# EAGLE schematic dosimeter (EAGLE 6.1)
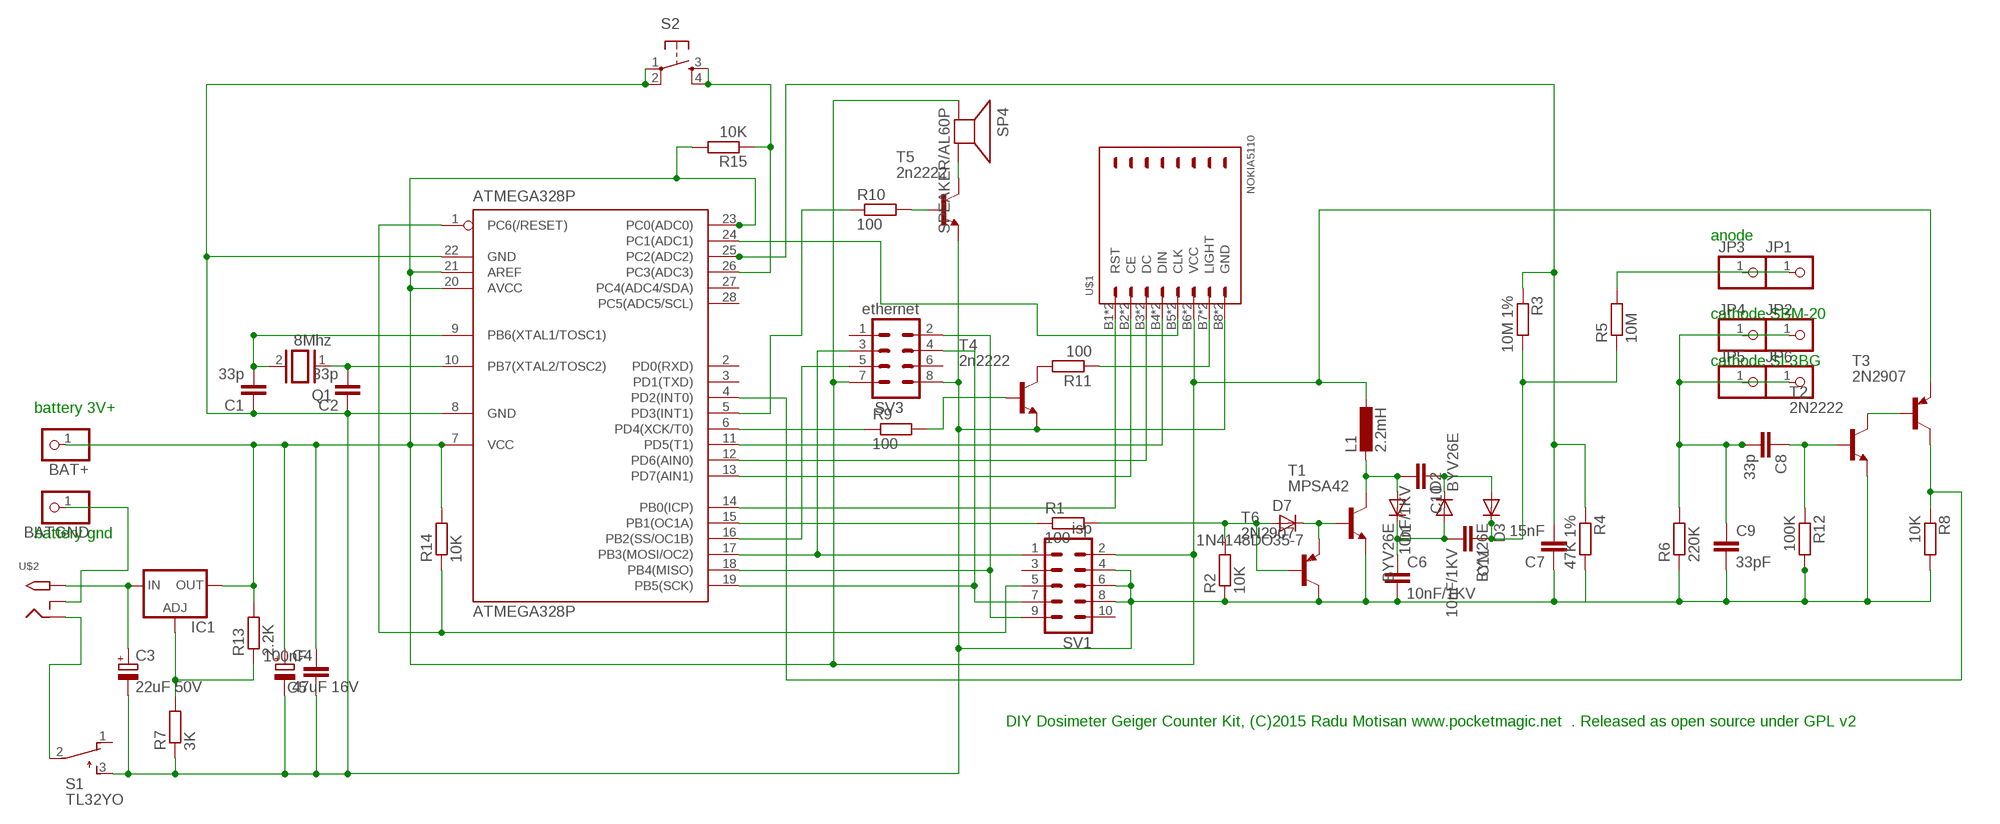
[diagram p0: schematic, sheet 1]

## Parts
ATMEGA328P  ATMEGA328P  MEGA8-P  [DIL28-3]
BAT+  PINHD-1X1  [1X01]
BATGND  PINHD-1X1  [1X01]
C1  33p  C2.5/2  [C2.5-2]
C2  33p  C2.5/2  [C2.5-2]
C3  22uF 50V  CPOL-EUE2-5  [E2-5]
C4  47uF 16V  CPOL-EUE2-5  [E2-5]
C5  100nF  C2.5/2  [C2.5-2]
C6  10nF/1KV  C5/3  [C5B3]
C7  15nF  C2.5/2  [C2.5-2]
C8  33p  C2.5/2  [C2.5-2]
C9  33pF  C2.5/2  [C2.5-2]
C10  10nF/1KV  C5/3  [C5B3]
C11  10nF/1KV  C5/3  [C5B3]
D1  BYV26E  1N40047.5  [D-7.5]
D2  BYV26E  1N40047.5  [D-7.5]
D3  BYV26E  1N40047.5  [D-7.5]
D7  1N4148DO35-7  [DO35-7]
IC1  LM317TL  [317TL]
JP1  PINHD-1X1  [1X01]
JP2  PINHD-1X1  [1X01]
JP3  PINHD-1X1  [1X01]
JP4  PINHD-1X1  [1X01]
JP5  PINHD-1X1  [1X01]
JP6  PINHD-1X1  [1X01]
L1  2.2mH  L-EU0207/10  [0207/10]
Q1  8Mhz  XTAL/S  [QS]
R1  100  R-EU_0204/7  [0204/7]
R2  10K  R-EU_0204/7  [0204/7]
R3  10M 1%  R-EU_0204/7  [0204/7]
R4  47K 1%  R-EU_0204/7  [0204/7]
R5  10M  R-EU_0204/7  [0204/7]
R6  220K  R-EU_0204/7  [0204/7]
R7  3K  R-EU_0204/7  [0204/7]
R8  10K  R-EU_0204/7  [0204/7]
R9  100  R-EU_0204/7  [0204/7]
R10  100  R-EU_0204/7  [0204/7]
R11  100  R-EU_0204/7  [0204/7]
R12  100K  R-EU_0204/7  [0204/7]
R13  2.2K  R-EU_0204/7  [0204/7]
R14  10K  R-EU_0204/7  [0204/7]
R15  10K  R-EU_0204/7  [0204/7]
S1  TL32YO  [TL3XYO]
S2  TAC_SWITCHPTH  [TACTILE-PTH]
SP4  SPEAKER/AL60P  [AL60P]
SV1  isp  MA05-2  [MA05-2]
SV3  ethernet  MA04-2  [MA04-2]
T1  MPSA42  2N2222  [TO92-EBC-OVAL]
T2  2N2222  [TO92-EBC-OVAL]
T3  2N2907  [TO92-EBC-OVAL]
T4  2n2222  2N2222-NPN-TO92-EBC  [TO92-EBC]
T5  2n2222  2N2222-NPN-TO92-EBC  [TO92-EBC]
T6  2N2907  [TO92-EBC-OVAL]
U$1  NOKIA5110  [NOKIA5110]
U$2  2.1MMJACKTHM  [PJ-102A]

## Nets
GND: ATMEGA328P.8(GND) ATMEGA328P.22(GND) C1.1 C2.1 C3.- C4.- C5.1 C6.2 C7.1 C9.2 R2.1 R4.2 R6.1 R7.1 R8.2 R12.2 S1.3(S) S2.1 S2.2 SV1.4 SV1.6 SV1.8 SV3.8 T1.E T2.E T4.E T5.E T6.C U$1.B8(GND) U$1.T8(GND)
N$1: ATMEGA328P.9(PB6(XTAL1/TOSC1)) C1.2 Q1.2
N$2: ATMEGA328P.10(PB7(XTAL2/TOSC2)) C2.2 Q1.1
N$3: R11.2 T4.C
N$4: ATMEGA328P.17(PB3(MOSI/OC2)) SV1.1 SV3.3
N$5: ATMEGA328P.16(PB2(SS/OC1B)) SV3.5
N$6: ATMEGA328P.18(PB4(MISO)) SV1.9 SV3.2
N$7: R9.2 T4.B
N$8: ATMEGA328P.19(PB5(SCK)) SV1.7 SV3.4
N$9: R11.1 U$1.B7(LIGHT) U$1.T7(LIGHT)
N$10: C10.2 D1.A L1.2 T1.C
N$11: ATMEGA328P.1(PC6(/RESET)) R14.1 SV1.5
N$13: ATMEGA328P.24(PC1(ADC1)) U$1.B5(CLK) U$1.T5(CLK)
N$14: ATMEGA328P.26(PC3(ADC3)) R15.1 S2.3 S2.4
N$15: S1.2(P) U$2.RING
N$16: C10.1 D2.C D3.A
N$18: JP1.1 JP3.1 R5.2
N$20: BATGND.1 U$2.RING_SW
N$21: ATMEGA328P.11(PD5(T1)) U$1.B4(DIN) U$1.T4(DIN)
N$22: ATMEGA328P.12(PD6(AIN0)) U$1.B3(DC) U$1.T3(DC)
N$23: ATMEGA328P.13(PD7(AIN1)) U$1.B2(CE) U$1.T2(CE)
N$24: ATMEGA328P.14(PB0(ICP)) U$1.B1(RST) U$1.T1(RST)
N$25: ATMEGA328P.7(VCC) ATMEGA328P.20(AVCC) ATMEGA328P.21(AREF) ATMEGA328P.23(PC0(ADC0)) BAT+.1 C4.+ C5.2 IC1.2(OUT) L1.1 R13.2 R14.2 R15.2 SP4.1(+) SV1.2 SV3.7 T3.E U$1.B6(VCC) U$1.T6(VCC)
N$26: ATMEGA328P.15(PB1(OC1A)) R1.1
N$27: D7.A R1.2 R2.2 T6.B
N$28: C3.+ IC1.3(IN) U$2.TIP
N$30: C6.1 C11.2 D1.C D2.A
N$31: C11.1 D3.C R3.2 R5.1
N$34: ATMEGA328P.6(PD4(XCK/T0)) R9.1
N$40: SP4.2(-) T5.C
N$41: R10.2 T5.B
N$42: ATMEGA328P.5(PD3(INT1)) R10.1
N$48: IC1.1(ADJ) R7.2 R13.1
N$52: C8.2 C9.1 JP2.1 JP4.1 JP5.1 JP6.1 R6.2
N$54: ATMEGA328P.25(PC2(ADC2)) C7.2 R3.1 R4.1
N$56: C8.1 R12.1 T2.B
N$59: T2.C T3.B
N$60: ATMEGA328P.4(PD2(INT0)) R8.1 T3.C
N$74: D7.C T1.B T6.E
Unconnected: ATMEGA328P.2(PD0(RXD)) ATMEGA328P.3(PD1(TXD)) ATMEGA328P.27(PC4(ADC4/SDA)) ATMEGA328P.28(PC5(ADC5/SCL)) S1.1(O) SV1.3 SV1.10 SV3.1 SV3.6

## Notes on the sheet
- anode
- cathode SBM-20
- cathode SI-3BG
- battery 3V+
- battery gnd
- DIY Dosimeter Geiger Counter Kit, (C)2015 Radu Motisan www.pocketmagic.net  . Released as open source under GPL v2

## Library data of the parts
ATMEGA328P = atmel:MEGA8-P: MICROCONTROLLER 8 Kbytes FLASH, 1 kbytes SRAM, 512 bytes EEPROM, USART, 4-channel 10 bit ADC, 2-channel 8 bit ADC Pin compatible with Atmega48, ATMega88, ATMega168 Source: avr.lbr; OC_FARNELL: unknown; OC_NEWARK: unknown
BAT+ BATGND JP1-JP6 = adafruit:PINHD-1X1: Pin header 1x1 for 0.1" spacing With round pins
C1 C2 C5-C11 = capacitor-wima:C: CAPACITOR naming: grid - package width
C3 C4 = resistor:CPOL-EU: POLARIZED CAPACITOR, European symbol
D1-D3 = diode:1N4004: DIODE general purpose rectifier, 1 A
D7 = Diode2:1N4148: DIODE high speed (Philips)
IC1 = v-reg:LM317TL: VOLTAGE REGULATOR
L1 = rcl:L-EU: INDUCTOR, European symbol
Q1 = special:XTAL/S: CRYSTAL
R1-R15 = rcl:R-EU_: RESISTOR, European symbol
S1 = switch:TL32YO: TINY SWITCH ON - MOM Source: http://www2.produktinfo.conrad.com/datenblaetter/700000-724999/705152-da-01-de-Subminiaturschalter_TL_36YO.pdf
S2 = sparkfun-electromechanical:TAC_SWITCH: Momentary Switch Button commonly used for reset or general input. Spark Fun Electronics SKU : COM-00097 SMT- SWCH-08247
SP4 = adafruit:SPEAKER: SPEAKER Source: Buerklin Added PS12 (for part # PS1240 piezo) http://www.ladyada.net/library/pcb/eaglelibrary.html
SV1 = con-lstb:MA05-2: PIN HEADER; OC_FARNELL: unknown; OC_NEWARK: unknown
SV3 = con-lstb:MA04-2: PIN HEADER; OC_FARNELL: unknown; OC_NEWARK: unknown
T1 T2 = adafruit:2N2222: NPN TRANSISTOR Big oval pads
T3 T6 = adafruit:2N2907*: PNP Transistor Big Oval pads
T4 T5 = transistor-neu-to92:*-NPN-: NPN Transistror
U$1 = NOKIA5110_OK:NOKIA5110
U$2 = adafruit:2.1MMJACK: 2.1mm x 5.5mm THM DC jack with internal switch. Digikey part #PJ-102A, 4UCON part #05537 2.1mm x 5.5mm SMT DC jack with internal switch. Digikey part #PJ-002A-SMT, 4UCON part #03267 By microbuilder.eu & adafruit.com